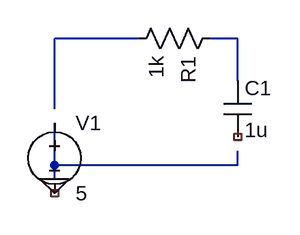
[diagram p0: schematic rc_lowpass.asc]
rc_lowpass.asc, the LTspice schematic file:
Version 4
SHEET 1 880 680
WIRE 192 96 96 96
WIRE 304 96 272 96
WIRE 304 144 304 96
WIRE 96 176 96 96
WIRE 304 240 304 224
WIRE 96 240 96 192
WIRE 304 240 96 240
WIRE 96 256 96 240
FLAG 96 256 0
SYMBOL voltage 96 176 R0
SYMATTR InstName V1
SYMATTR Value 5
SYMBOL res 288 80 R90
SYMATTR InstName R1
SYMATTR Value 1k
SYMBOL cap 288 144 R0
SYMATTR InstName C1
SYMATTR Value 1u

The netlist it stands for:
* rc_lowpass.asc
V1 0 NC_01 5
R1 N002 N001 1k
C1 N002 NC_02 1u
.backanno
.end